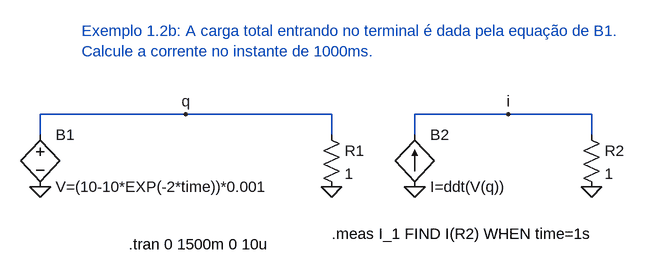
[diagram p0: schematic Exemplo 1_2b.asc]
Exemplo 1_2b.asc, the LTspice schematic file:
Version 4
SHEET 1 920 680
WIRE 128 64 -96 64
WIRE 352 64 128 64
WIRE 624 64 480 64
WIRE 752 64 624 64
WIRE -96 96 -96 64
WIRE 352 96 352 64
WIRE 480 96 480 64
WIRE 752 96 752 64
FLAG -96 176 0
FLAG 352 176 0
FLAG 128 64 q
FLAG 480 176 0
FLAG 752 176 0
FLAG 624 64 i
SYMBOL bv -96 80 R0
SYMATTR InstName B1
SYMATTR Value V=(10-10*EXP(-2*time))*0.001
SYMBOL res 336 80 R0
SYMATTR InstName R1
SYMATTR Value 1
SYMBOL res 736 80 R0
SYMATTR InstName R2
SYMATTR Value 1
SYMBOL bi 480 176 M180
WINDOW 0 24 80 Left 2
WINDOW 3 24 0 Left 2
SYMATTR InstName B2
SYMATTR Value I=ddt(V(q))
TEXT 40 264 Left 2 !.tran 0 1500m 0 10u
TEXT -32 -64 Left 2 ;Exemplo 1.2b: A carga total entrando no terminal é dada pela equação de B1.\nCalcule a corrente no instante de 1000ms.
TEXT 352 248 Left 2 !.meas I_1 FIND I(R2) WHEN time=1s

The netlist it stands for:
* Exemplo 1_2b.asc
B1 q 0 V=(10-10*EXP(-2*time))*0.001
R1 q 0 1
R2 i 0 1
B2 0 i I=ddt(V(q))
.tran 0 1500m 0 10u
* Exemplo 1.2b: A carga total entrando no terminal é dada pela equação de B1.
* Calcule a corrente no instante de 1000ms.
.meas I_1 FIND I(R2) WHEN time=1s
.backanno
.end